# EAGLE design b333 (EAGLE 6.3)

## Sheet 1 of 3
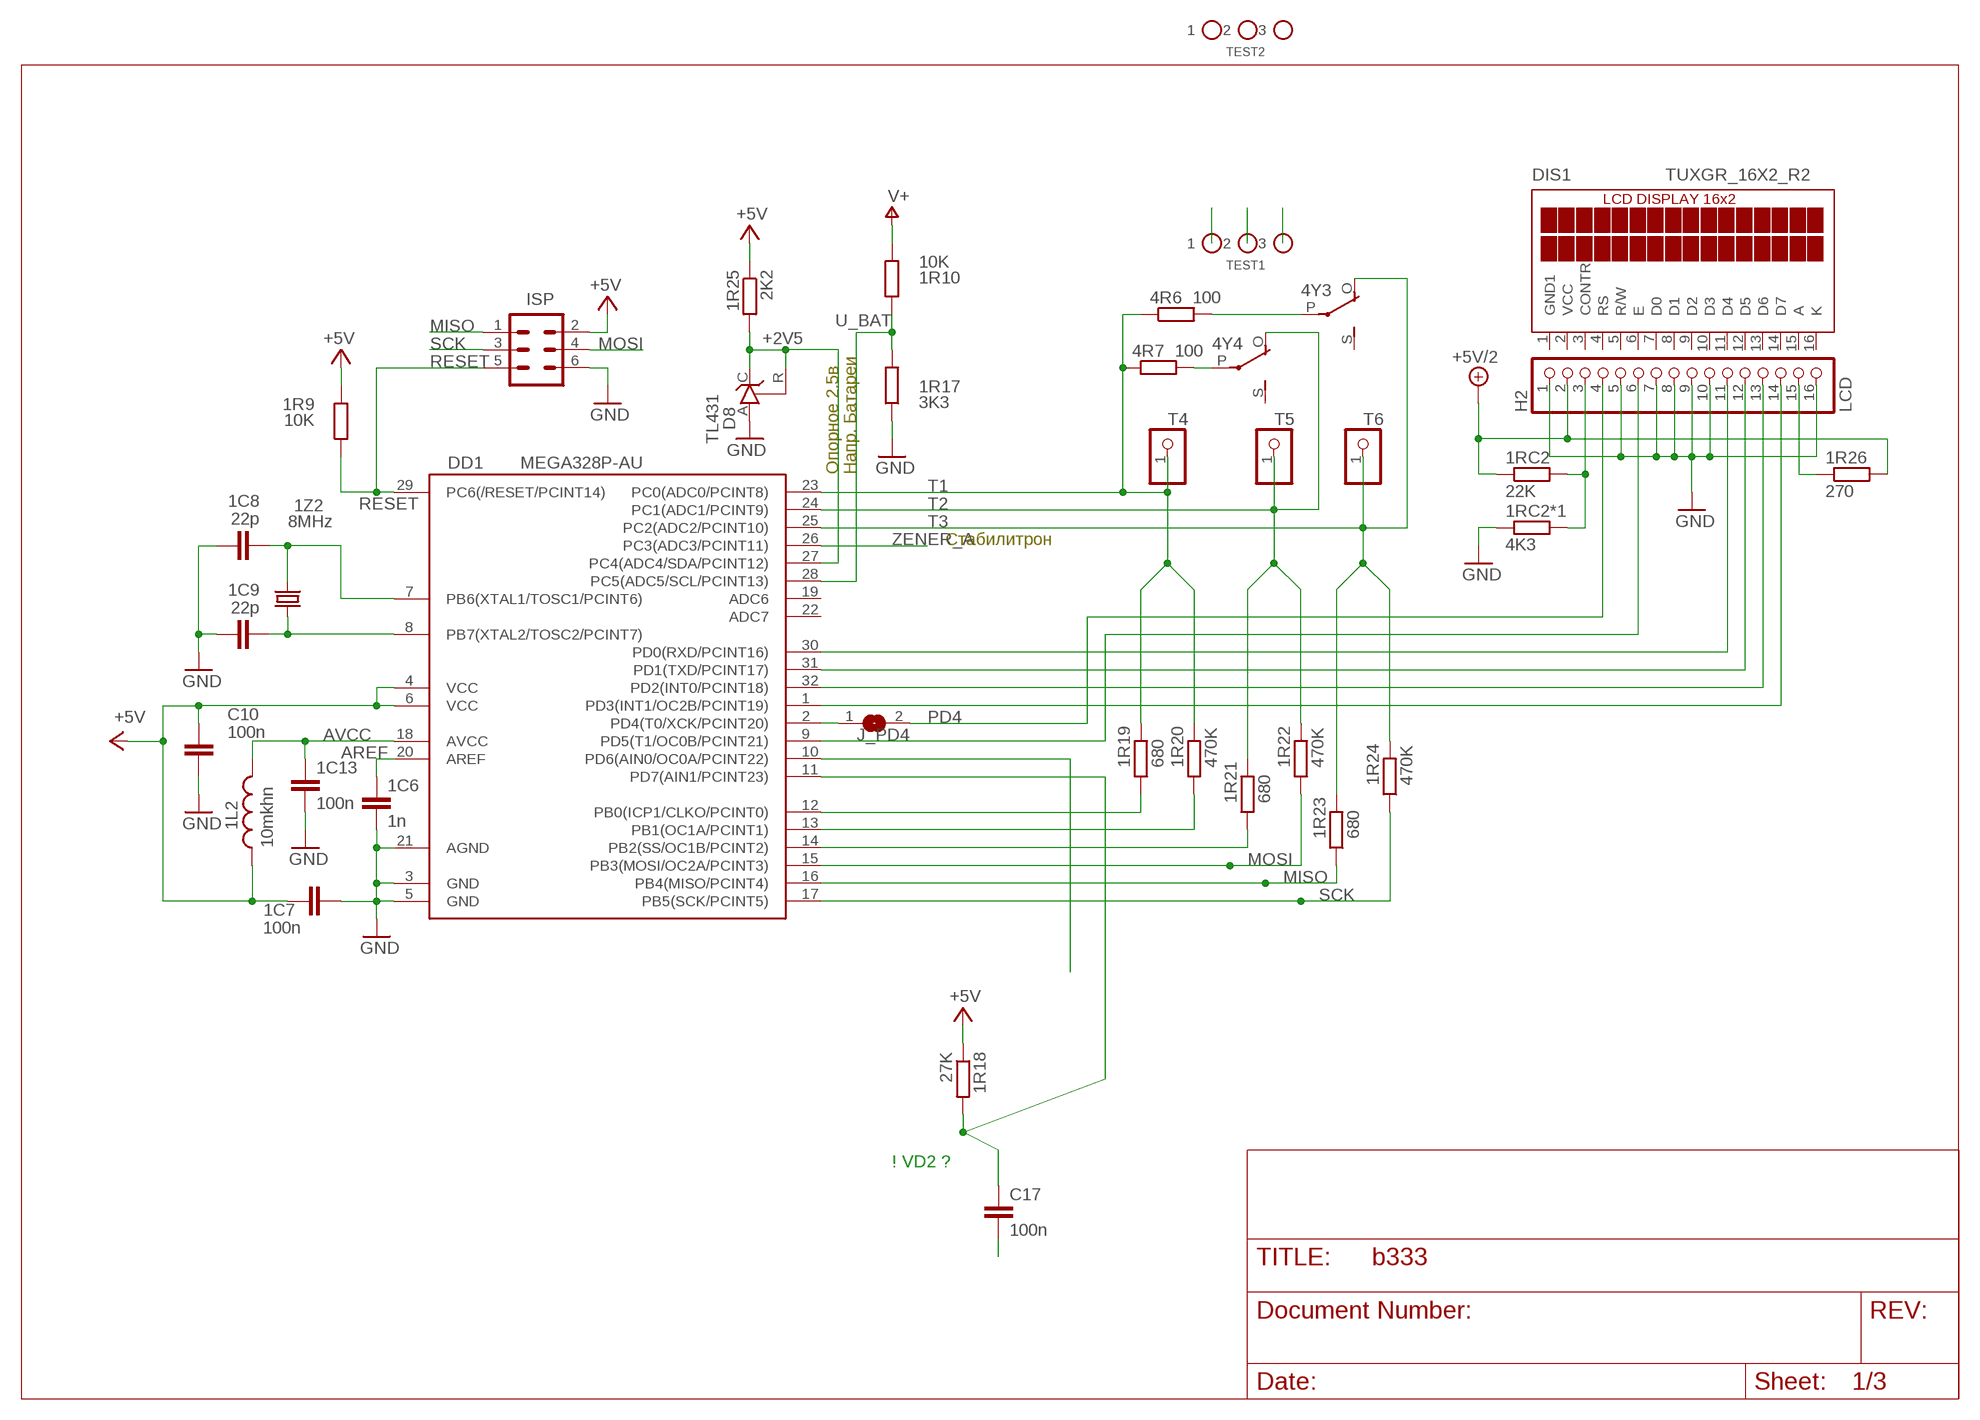
[diagram p0: schematic, sheet 1]

### Parts
1C6  1n  C-EUC0805K  [C0805K]
1C7  100n  C-EUC0805K  [C0805K]
1C8  22p  C-EUC0805K  [C0805K]
1C9  22p  C-EUC0805K  [C0805K]
1C13  100n  C-EUC0805K  [C0805K]
1L2  10mkhn  L-USIRF-24  [IRF24]
1R9  10K  R-EU_R0805  [R0805]
1R10  10K  R-EU_R0805  [R0805]
1R17  3K3  R-EU_R1206W  [R1206W]
1R18  27K  R-EU_R0805  [R0805]
1R19  680  R-EU_M0805  [M0805]
1R20  470K  R-EU_M0805  [M0805]
1R21  680  R-EU_M0805  [M0805]
1R22  470K  R-EU_M0805  [M0805]
1R23  680  R-EU_M0805  [M0805]
1R24  470K  R-EU_M0805  [M0805]
1R25  2K2  R-EU_R0805  [R0805]
1R26  270  R-EU_R1206W  [R1206W]
1RC2  22K  R-EU_R0805  [R0805]
1RC2*1  4K3  R-EU_R1206W  [R1206W]
1Z2  8MHz  CRYSTALHC49U70  [HC49U70]
4R6  100  R-EU_R0805  [R0805]
4R7  100  R-EU_R0805  [R0805]
4Y3  РЭС55А  [РЭС55А]
4Y4  РЭС55А  [РЭС55А]
C10  100n  C-EUC0805  [C0805]
C17  100n  C-EUC0805K  [C0805K]
D8  TL431  TL431CLP  [TO92-CLP]
DD1  MEGA328P-AU  MEGA48/88/168-AU  [TQFP32-08]
DIS1  TUXGR_16X2_R2  [TUXGR_16X2_R2]
H2  LCD  PINHD-1X16  [1X16]
ISP  MA03-2  [MA03-2]
J_PD4  SJ  [SJ]
T4  PINHD-1X1  [1X01]
T5  PINHD-1X1  [1X01]
T6  PINHD-1X1  [1X01]
TEST1  TT-P  [TT-P]
TEST2  TT-P  [TT-P]

### Nets
+2V5: 1R25.2 D8.C D8.R DD1.27(PC4(ADC4/SDA/PCINT12))
+5V: 1C7.1 1L2.2 1R9.2 1R18.1 1R25.1 C10.1 DD1.4(VCC) DD1.6(VCC) ISP.2 ; also sheet 2
+5V/2: 1R26.2 1RC2.1 H2.2 ; also sheet 2
AREF: 1C6.1 DD1.20(AREF)
AVCC: 1C13.1 1L2.1 DD1.18(AVCC)
E1: DD1.9(PD5(T1/OC0B/PCINT21)) H2.6
GND: 1C6.2 1C7.2 1C8.1 1C9.1 1C13.2 1R17.1 1RC2*1.1 C10.2 C17.2 D8.A DD1.3(GND) DD1.5(GND) DD1.21(AGND) H2.1 H2.5 H2.7 H2.8 H2.9 H2.10 H2.16 ISP.6 ; also sheet 2,3
MISO: 1R23.1 DD1.16(PB4(MISO/PCINT4)) ISP.1
MOSI: 1R22.1 DD1.15(PB3(MOSI/OC2A/PCINT3)) ISP.4
N$4: DD1.2(PD4(T0/XCK/PCINT20)) J_PD4.1
N$60: 1RC2*1.2 1RC2.2 H2.3
N$61: 1R26.1 H2.15
N$62: DD1.1(PD3(INT1/OC2B/PCINT19)) H2.14
N$68: 1C8.2 1Z2.2 DD1.7(PB6(XTAL1/TOSC1/PCINT6))
N$69: 1C9.2 1Z2.1 DD1.8(PB7(XTAL2/TOSC2/PCINT7))
N$71: 4R6.2 4Y3.P
N$72: 4R7.2 4Y4.P
N$87: DD1.30(PD0(RXD/PCINT16)) H2.11
N$88: DD1.31(PD1(TXD/PCINT17)) H2.12
N$89: DD1.32(PD2(INT0/PCINT18)) H2.13
PB3: 1R19.1 DD1.12(PB0(ICP1/CLKO/PCINT0))
PB4: 1R20.1 DD1.13(PB1(OC1A/PCINT1))
PB5: 1R21.1 DD1.14(PB2(SS/OC1B/PCINT2))
PD1: 1R18.2 C17.1 DD1.11(PD7(AIN1/PCINT23))
PD2: DD1.10(PD6(AIN0/OC0A/PCINT22))
PD4: H2.4 J_PD4.2 ; also sheet 3
RESET: 1R9.1 DD1.29(PC6(/RESET/PCINT14)) ISP.5
SCK: 1R24.1 DD1.17(PB5(SCK/PCINT5)) ISP.3
T1: 1R19.2 1R20.2 4R6.1 4R7.1 DD1.23(PC0(ADC0/PCINT8)) T4.1 TEST1.P$5
T2: 1R21.2 1R22.2 4Y4.O DD1.24(PC1(ADC1/PCINT9)) T5.1 TEST1.P$2 TEST1.P$3 TEST1.P$4
T3: 1R23.2 1R24.2 4Y3.O DD1.25(PC2(ADC2/PCINT10)) T6.1 TEST1.P$1
U_BAT: 1R10.2 1R17.2 DD1.28(PC5(ADC5/SCL/PCINT13))
V+: 1R10.1 ; also sheet 2
ZENER_A: DD1.26(PC3(ADC3/PCINT11)) ; also sheet 2
Unconnected: 4Y3.1 4Y3.2 4Y3.G 4Y3.S 4Y4.1 4Y4.2 4Y4.G 4Y4.S DD1.19(ADC6) DD1.22(ADC7) DIS1.3(CONTR) DIS1.4(RS) DIS1.5(R/W) DIS1.6(E) DIS1.7(D0) DIS1.8(D1) DIS1.9(D2) DIS1.10(D3) DIS1.11(D4) DIS1.12(D5) DIS1.13(D6) DIS1.14(D7) DIS1.15(A) DIS1.16(K) TEST2.P$1 TEST2.P$2 TEST2.P$3 TEST2.P$4 TEST2.P$5

### Notes on the sheet
- Опорное 2.5в | Напр. Батареи
- Стабилитрон
- ! VD2 ?

## Sheet 2 of 3
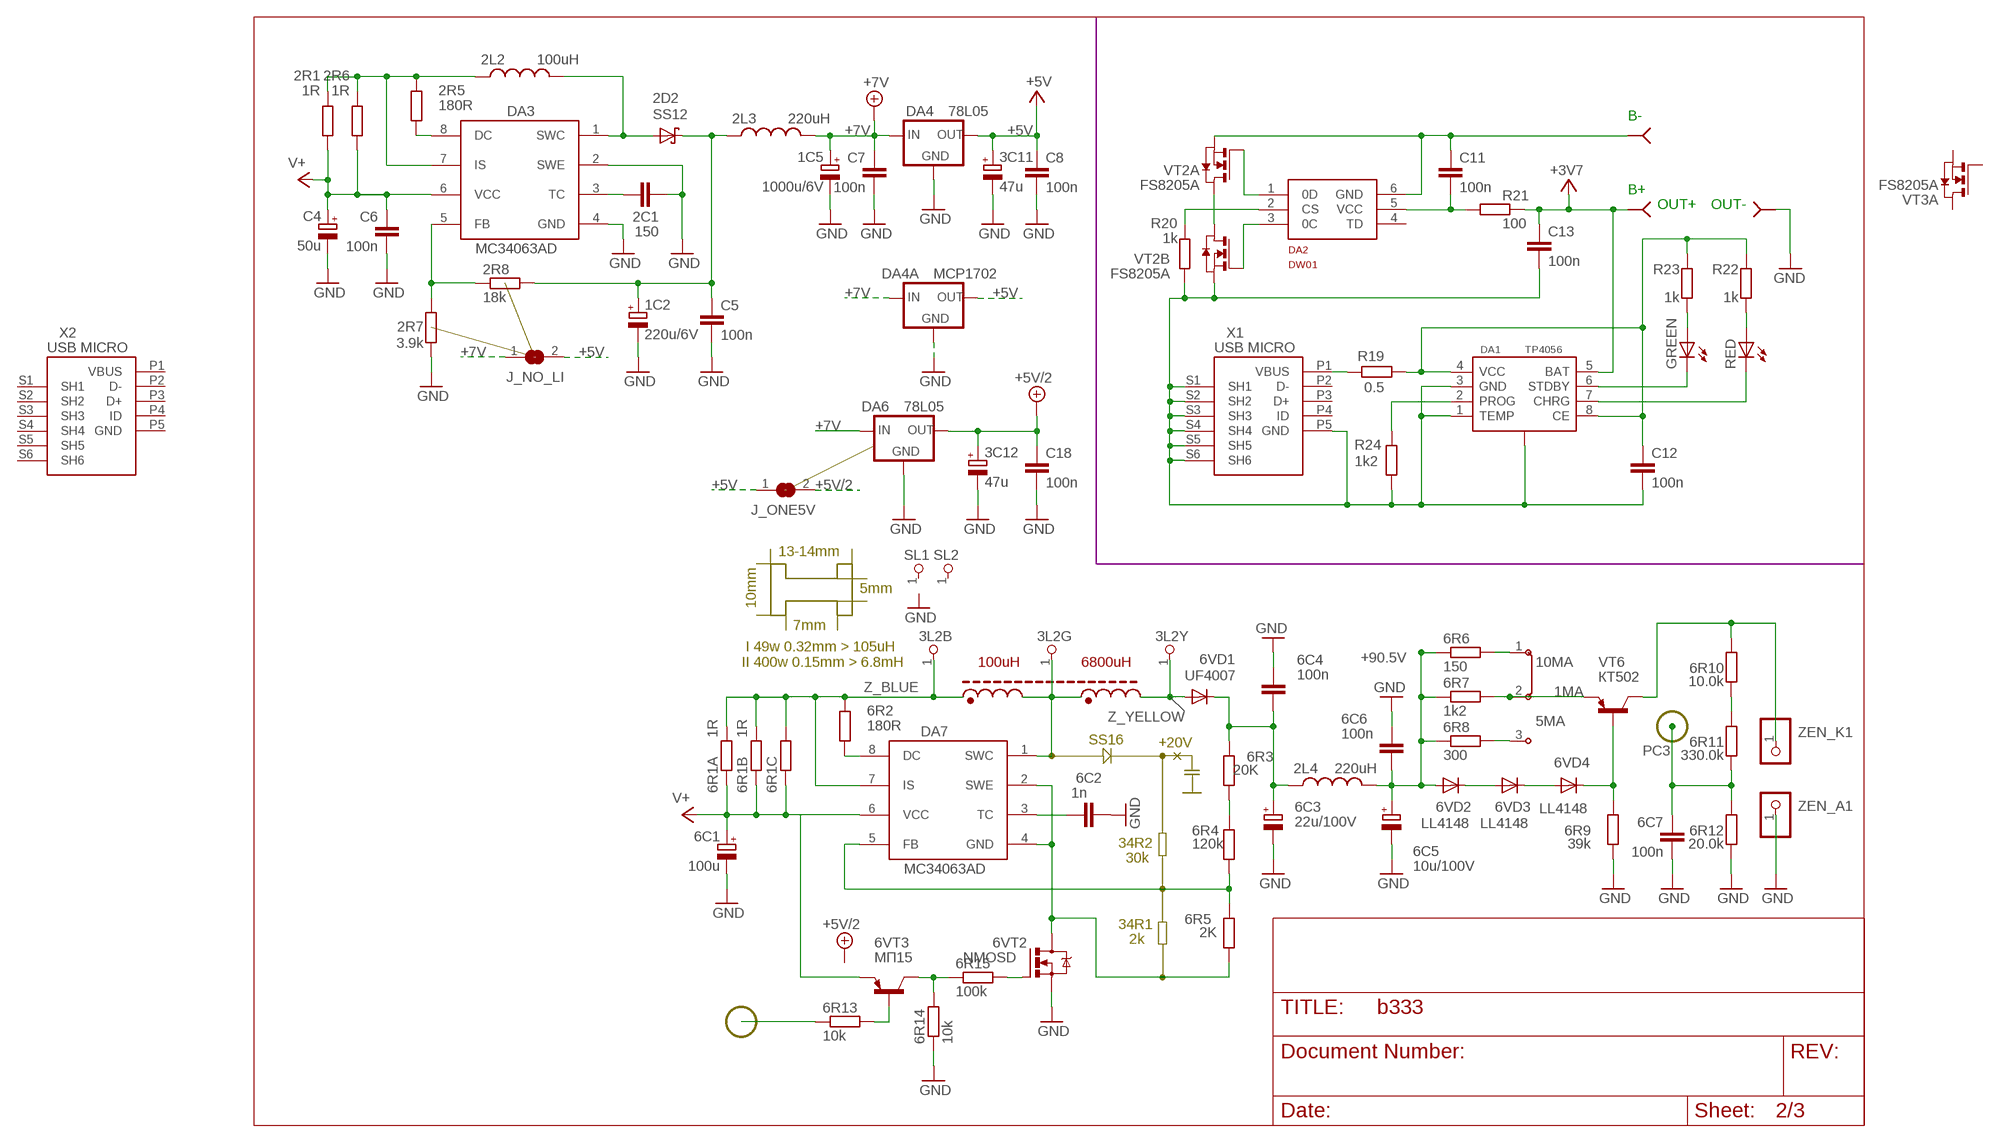
[diagram p1: schematic, sheet 2]

### Parts
1C2  220u/6V  CPOL-EUE2-5  [E2-5]
1C5  1000u/6V  CPOL-EUE2-5  [E2-5]
2C1  150  C-EUC0805K  [C0805K]
2D2  SS12  SCHOTTKY-DIODESMD  [SMB]
2L2  100uH  L_LH7X10MM  [LH7X10MM]
2L3  220uH  L_LV7X10MM  [LV7X10MM]
2L4  220uH  L-US6000-XXX-RC  [6000-XXXX-RC]
2R1  1R  R-EU_R0805  [R0805]
2R5  180R  R-EU_R0805  [R0805]
2R6  1R  R-EU_R0805  [R0805]
2R7  3.9k  R-EU_R0805  [R0805]
2R8  18k  R-EU_R0805  [R0805]
3C11  47u  CPOL-EUE2.5-6  [E2,5-6]
3C12  47u  CPOL-EUE2.5-6  [E2,5-6]
3L2B  PINHD-1X1  [1X01]
3L2G  PINHD-1X1  [1X01]
3L2Y  PINHD-1X1  [1X01]
5MA  10MA  JP2N  [JP2]
6C1  100u  CPOL-EUE2.5-6  [E2,5-6]
6C2  1n  C-EUC0805K  [C0805K]
6C3  22u/100V  CPOL-EUTT5D9L  [TT5D9L]
6C4  100n  C-EU050-025X075  [C050-025X075]
6C5  10u/100V  CPOL-EUE2.5-6  [E2,5-6]
6C6  100n  C-EU025-025X050  [C025-025X050]
6C7  100n  C-EU025-025X050  [C025-025X050]
6R1A  1R  R-EU_R1206  [R1206]
6R1B  1R  R-EU_R1206  [R1206]
6R1C  R-EU_R1206  [R1206]
6R2  180R  R-EU_R0805  [R0805]
6R3  20K  R-EU_R0805  [R0805]
6R4  120k  R-EU_R0805  [R0805]
6R5  2K  R-EU_R0805  [R0805]
6R6  150  R-EU_R0805  [R0805]
6R7  1k2  R-EU_R0805  [R0805]
6R8  300  R-EU_R0805  [R0805]
6R9  39k  R-EU_R0805  [R0805]
6R10  10.0k  R-EU_R0805  [R0805]
6R11  330.0k  R-EU_R0805  [R0805]
6R12  20.0k  R-EU_R0805  [R0805]
6R13  10k  R-EU_R0805  [R0805]
6R14  10k  R-EU_R0805  [R0805]
6R15  100k  R-EU_R0805  [R0805]
6VD1  UF4007  1N4004  [DO41-10]
6VD2  LL4148  DIODE-SOD80C  [SOD80C]
6VD3  LL4148  DIODE-SOD80C  [SOD80C]
6VD4  LL4148  DIODE-SOD80C  [SOD80C]
6VT2  NMOSD  [DPACK_1]
6VT3  МП15  BF423  [TO92-BCE]
B+OUT+  B-  [PAD-]
B-1  B-  [PAD-]
C4  50u  CPOL-EUE2.5-6  [E2,5-6]
C5  100n  C-EUC0805K  [C0805K]
C6  100n  C-EUC0805K  [C0805K]
C7  100n  C-EUC0805K  [C0805K]
C8  100n  C-EUC0805K  [C0805K]
C11  100n  C-EUC0805  [C0805]
C12  100n  C-EUC0805  [C0805]
C13  100n  C-EUC0805  [C0805]
C18  100n  C-EUC0805K  [C0805K]
DA1  TP4056  [SOP-8]
DA2  DW01A  DW01  [SOT23-6]
DA3  MC34063AD  [SOIC8]
DA4  78L05  78LXX_SOT89  [SOT89R]
DA4A  MCP1702  [SOT89R]
DA6  78L05  78LXX_SOT89  [SOT89R]
DA7  MC34063AD  [SOIC8]
GND  B-  [PAD-]
GREEN  LEDCHIP-LED0805  [CHIP-LED0805]
J_NO_LI  SJ  [SJ]
J_ONE5V  SJ  [SJ]
L  L  [L]
R19  0.5  R-EU_R0805  [R0805]
R20  1k  R-EU_R0805  [R0805]
R21  100  R-EU_R0805  [R0805]
R22  1k  R-EU_R0805  [R0805]
R23  1k  R-EU_R0805  [R0805]
R24  1k2  R-EU_0204/7  [0204/7]
RED  LEDCHIP-LED0805  [CHIP-LED0805]
SL1  PINHD-1X1  [1X01]
SL2  PINHD-1X1  [1X01]
VT2  FS8205A  DMN3024LSD  [TSSOP-8]
VT3  FS8205A  DMN3024LSD  [TSSOP-8]
VT6  КТ502  BF423  [TO92-BCE]
X1  USB MICRO  MYCON2_USB-MINI-B  [CON2_USB_MICRO_B_AT]
X2  USB MICRO  MYCON2_USB-MINI-B  [CON2_USB_MICRO_B_AT]
ZEN_A1  PINHD-1X1  [1X01]
ZEN_K1  PINHD-1X1  [1X01]

### Nets
1MA: 5MA.2 6R7.2 VT6.E
5: 6R4.1 6R5.2 DA7.5(FB)
!BUTTON1: 6R13.1
+3V7: B+OUT+.B- C13.1 DA1.5(BAT) R21.2
+5V: 3C11.+ C8.1 DA4.2(OUT) DA4A.1(OUT) J_NO_LI.2 J_ONE5V.1 ; also sheet 1
+5V/2: 3C12.+ C18.1 DA6.2(OUT) J_ONE5V.2 ; also sheet 1
+7V: 1C5.+ 2L3.2 C7.1 DA4.1(IN) DA4A.3(IN) DA4A.4(IN) DA6.1(IN) J_NO_LI.1
+90.5V: 2L4.2 6C5.+ 6C6.2 6R6.1 6R7.1 6R8.1 6VD2.A
B-: B-1.B- C11.1 DA2.6(GND) VT2.2(A:S) VT2.3(A:S)
GND: 1C2.- 1C5.- 2C1.2 2R7.1 3C11.- 3C12.- 6C1.- 6C2.2 6C3.- 6C4.1 6C5.- 6C6.1 6C7.2 6R9.1 6R12.1 6R14.1 6VT2.S C4.- C5.2 C6.2 C7.2 C8.2 C18.2 DA3.2(SWE) DA3.4(GND) DA4.3(GND) DA4.4(GND) DA4A.2(GND) DA6.3(GND) DA6.4(GND) GND.B- ZEN_A1.1 ; also sheet 1,3
N$8: 2C1.1 DA3.3(TC)
N$12: 6R5.1 6VT2.D DA7.2(SWE) DA7.4(GND)
N$13: 2D2.A 2L2.2 DA3.1(SWC)
N$14: 2L2.1 2R1.2 2R5.1 2R6.2 DA3.7(IS)
N$15: 2R5.2 DA3.8(DC)
N$16: 2R7.2 2R8.1 DA3.5(FB)
N$17: 1C2.+ 2D2.C 2L3.1 2R8.2 C5.1
N$19: 2L4.1 6C3.+ 6C4.2 6R3.2 6VD1.C
N$21: 6R14.2 6R15.1 6VT3.C
N$22: 6C2.1 DA7.3(TC)
N$23: 6R3.1 6R4.2
N$24: 6R10.1 6R11.2
N$52: 6R2.2 DA7.8(DC)
N$55: 5MA.3 6R8.2
N$59: 5MA.1 6R6.2
N$65: 6VD2.C 6VD3.A
N$66: 6VD3.C 6VD4.A
N$67: 6R9.2 6VD4.C VT6.B
N$75: VT2.1(A:D) VT2.8(B:D)
N$76: DA2.3(0C) VT2.5(B:G)
N$77: DA2.1(0D) VT2.4(A:G)
N$78: DA2.2(CS) R20.2
N$79: C11.2 DA2.5(VCC) R21.1
N$80: DA1.7(CHRG) RED.C
N$81: DA1.6(STDBY) GREEN.C
N$82: R22.1 RED.A
N$83: GREEN.A R23.1
N$84: C12.1 DA1.4(VCC) DA1.8(CE) R19.2 R22.2 R23.2
N$85: R19.1 X1.P1(VBUS)
N$86: DA1.2(PROG) R24.2
N$95: 6R13.2 6VT3.B
N$96: 6R15.2 6VT2.G
PC3: 6C7.1 6R11.1 6R12.2
UGND: C12.2 C13.2 DA1.1(TEMP) DA1.3(GND) DA1.. R20.1 R24.1 VT2.6(B:S) VT2.7(B:S) X1.P5(GND) X1.S1(SH1) X1.S2(SH2) X1.S3(SH3) X1.S4(SH4) X1.S5(SH5) X1.S6(SH6)
V+: 2R1.1 2R6.1 6C1.+ 6R1A.1 6R1B.1 6R1C.1 6VT3.E C4.+ C6.1 DA3.6(VCC) DA7.6(VCC) ; also sheet 1
Z_BLUE: 3L2B.1 6R1A.2 6R1B.2 6R1C.2 6R2.1 DA7.7(IS)
Z_GREEN: 3L2G.1 DA7.1(SWC)
Z_YELLOW: 3L2Y.1 6VD1.A
ZENER_A: 6R10.2 VT6.C ZEN_K1.1 ; also sheet 1
Unconnected: DA2.4(TD) SL1.1 SL2.1 VT3.1(A:D) VT3.2(A:S) VT3.3(A:S) VT3.4(A:G) VT3.5(B:G) VT3.6(B:S) VT3.7(B:S) VT3.8(B:D) X1.P2(D-) X1.P3(D+) X1.P4(ID) X2.P2(D-) X2.P3(D+) X2.P4(ID) X2.P5(GND) X2.S1(SH1) X2.S2(SH2) X2.S3(SH3) X2.S4(SH4) X2.S5(SH5) X2.S6(SH6)

### Notes on the sheet
- B-
- B+
- OUT+ | OUT-
- I 49w 0.32mm > 105uH
  II 400w 0.15mm > 6.8mH
- 100uH | 6800uH
- +20V
- SS16
- 34R2
- 30k
- 34R1
- 2k

## Sheet 3 of 3
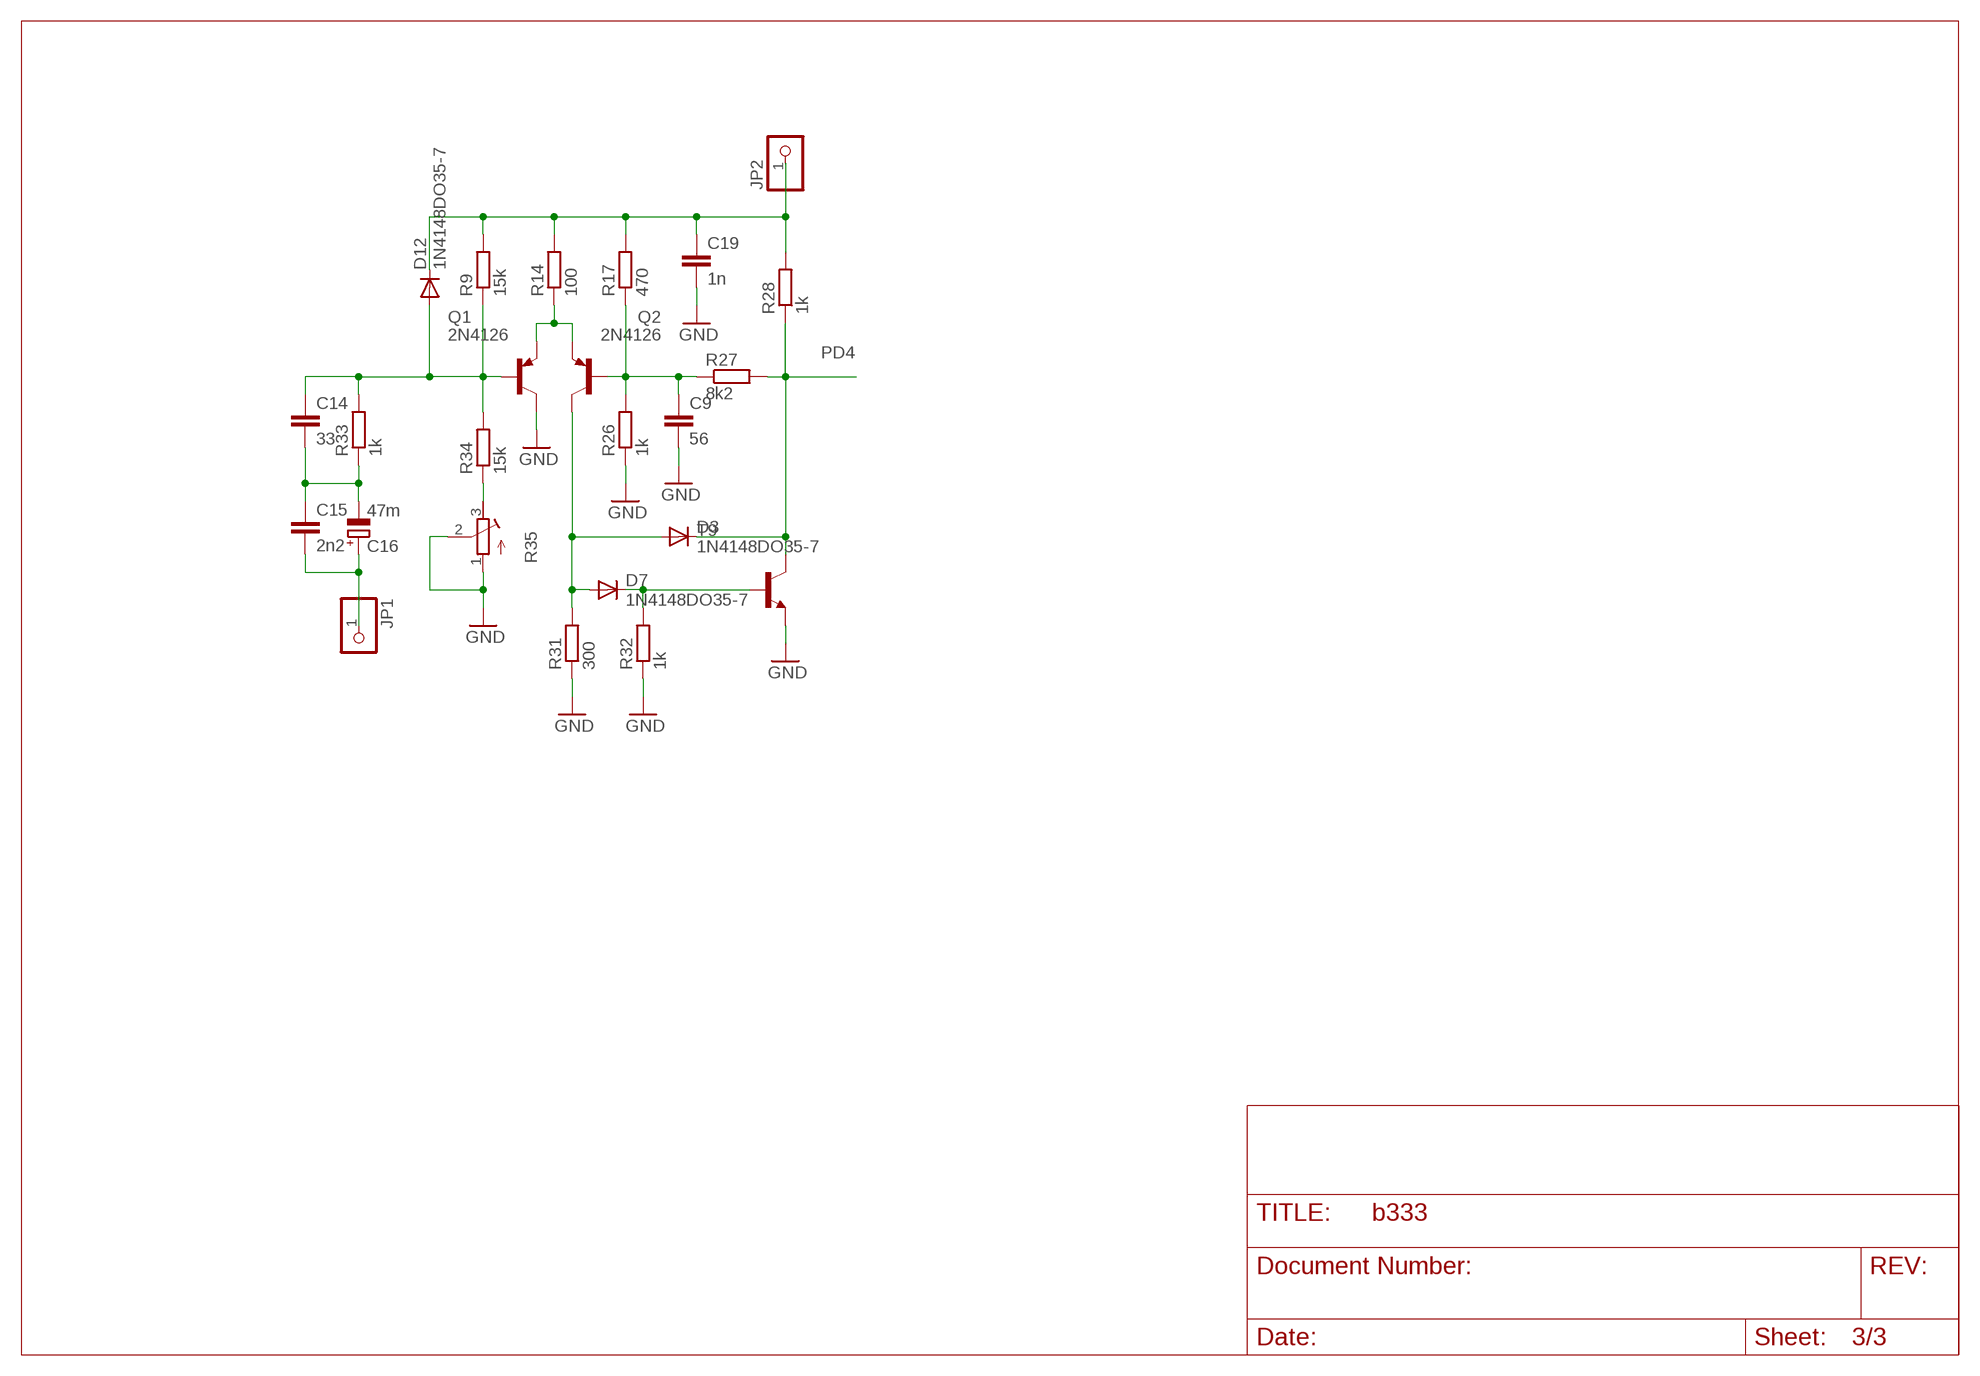
[diagram p2: schematic, sheet 3]

### Parts
C9  56  C-EUC0805K  [C0805K]
C14  33  C-EUC0805K  [C0805K]
C15  2n2  C-EUC0805K  [C0805K]
C16  47m  CPOL-EUE2-4  [E2-4]
C19  1n  C-EUC0805K  [C0805K]
D3  1N4148DO35-7  [DO35-7]
D7  1N4148DO35-7  [DO35-7]
D12  1N4148DO35-7  [DO35-7]
JP1  PINHD-1X1  [1X01]
JP2  PINHD-1X1  [1X01]
Q1  2N4126  [TO92-CBE]
Q2  2N4126  [TO92-CBE]
R9  15k  R-EU_M0805  [M0805]
R14  100  R-EU_M0805  [M0805]
R17  470  R-EU_M0805  [M0805]
R26  1k  R-EU_M0805  [M0805]
R27  8k2  R-EU_M0805  [M0805]
R28  1k  R-EU_M0805  [M0805]
R31  300  R-EU_M0805  [M0805]
R32  1k  R-EU_M0805  [M0805]
R33  1k  R-EU_M0805  [M0805]
R34  15k  R-EU_M0805  [M0805]
R35  R-TRIMM3296W  [RTRIM3296W]
T9  -NPN-TO92-EBC  [TO92-EBC]

### Nets
GND: C9.2 C19.2 Q1.C R26.1 R31.1 R32.1 R35.1(A) R35.2(S) T9.E ; also sheet 1,2
N$3: R34.1 R35.3(E)
N$90: Q1.E Q2.E R14.1
N$91: C14.1 D12.A Q1.B R9.1 R33.2 R34.2
N$93: C9.1 Q2.B R17.1 R26.2 R27.1
N$97: C19.1 D12.C JP2.1 R9.2 R14.2 R17.2 R28.2
N$100: D3.A D7.A Q2.C R31.2
N$101: C14.2 C15.1 C16.- R33.1
N$102: D7.C R32.2 T9.B
N$103: C15.2 C16.+ JP1.1
PD4: D3.C R27.2 R28.1 T9.C ; also sheet 1

## Power pins joined to a net without a drawn wire
GND1: DIS1.1(GND1)
VBUS: X2.P1(VBUS)
VCC: DIS1.2(VCC)

## Library data of the parts
1C2 1C5 3C11 3C12 6C1 6C5 C4 = resistor:CPOL-EU: POLARIZED CAPACITOR, European symbol
1C6-1C9 1C13 2C1 6C2 6C4 6C6 6C7 C5-C8 C10 C17 C18 = resistor:C-EU: CAPACITOR, European symbol
1L2 2L4 = rcl:L-US: INDUCTOR, American symbol
1R9 1R10 1R17-1R26 1RC2 1RC2*1 2R1 2R5-2R8 4R6 4R7 6R1A 6R1B 6R1C 6R2-6R15 R19-R24 = resistor:R-EU_: RESISTOR, European symbol
1Z2 = crystal:CRYSTAL: CRYSTAL; OC_FARNELL: 1666956; OC_NEWARK: unknown
2D2 = diode:SCHOTTKY-DIODE: Schottky Diode
2L2 2L3 = ct-pack:L_: INDUCTOR, American symbol
3L2B 3L2G 3L2Y SL1 SL2 = b333:PINHD-1X1: PIN HEADER
4Y3 4Y4 = relay_ussr:РЭС55
5MA = jumper:JP2N
6C3 = ct-pack:CPOL-EU: POLARIZED CAPACITOR, European symbol
6VD1 = diode:1N4004: DIODE general purpose rectifier, 1 A
6VD2-6VD4 = diode:DIODE-: DIODE
6VT2 = DSS:NMOS
6VT3 VT6 = transistor-pnp:BF423*: PNP Transistror
B+OUT+ B-1 GND = TP4056_18650:B-
C9 C11-C15 C19 = rcl:C-EU: CAPACITOR, European symbol
C16 = rcl:CPOL-EU: POLARIZED CAPACITOR, European symbol
D3 D7 D12 = diode:1N4148: DIODE high speed (Philips)
D8 = v-reg:TL431CLP: VOLTAGE REGULATOR
DA1 = TP4056:TP4056
DA2 = DW01:DW01: The DW01-P battery protection IC is designed to protect lithium-ion/polymer battery from damage or degrading the lifetime due to overcharge, overdischarge, and/or overcurrent for one-cell lithium-ion/polymer battery powered systems, such as cellular phones. Data sheet <http://goo.gl/4y108d> Dave.Calaway Eagle Library <https://goo.gl/Muy1Tr>
DA3 DA7 = mc34063-2:MC34063
DA4 DA6 = ct-pack:78LXX: VOLTAGE REGULATOR
DA4A = ct-pack:MCP1702
DD1 = avr-6:MEGA48/88/168
DIS1 = b333:TUXGR_16X2_R2: Tuxgraphics LCD display 16x2 characters reflective, without background light Source: tuxgr_12x2_r2.pdf; OC_FARNELL: unknown; OC_NEWARK: unknown
GREEN RED = led:LED: LED OSRAM: - CHIPLED LG R971, LG N971, LY N971, LG Q971, LY Q971, LO R971, LY R971 LH N974, LH R974 LS Q976, LO Q976, LY Q976 LO Q996 - Hyper CHIPLED LW Q18S LB Q993, LB Q99A, LB R99A - SideLED LS A670, LO A670, LY A670, LG A670, LP A670 LB A673, LV A673, LT A673, LW A673 LH A674 LY A675 LS A676, LA A676, LO A676, LY A676, LW A676 LS A679, LY A679, LG A679 - Hyper Micro SIDELED® LS Y876, LA Y876, LO Y876, LY Y876 LT Y87S - SmartLED LW L88C, LW L88S LB L89C, LB L89S, LG L890 LS L89K, LO L89K, LY L89K LS L896, LA L896, LO L896, LY L896 - TOPLED LS T670, LO T670, LY T670, LG T670, LP T670 LSG T670, LSP T670, LSY T670, LOP T670, LYG T670 LG T671, LOG T671, LSG T671 LB T673, LV T673, LT T673, LW T673 LH T674 LS T676, LA T676, LO T676, LY T676, LB T676, LH T676, LSB T676, LW T676 LB T67C, LV T67C, LT T67C, LS T67K, LO T67K, LY T67K, LW E67C LS E67B, LA E67B, LO E67B, LY E67B, LB E67C, LV E67C, LT E67C LW T67C LS T679, LY T679, LG T679 LS T770, LO T770, LY T770, LG T770, LP T770 LB T773, LV T773, LT T773, LW T773 LH T774 LS E675, LA E675, LY E675, LS T675 LS T776, LA T776, LO T776, LY T776, LB T776 LHGB T686 LT T68C, LB T68C - Hyper Mini TOPLED® LB M676 - Mini TOPLED Santana® LG M470 LS M47K, LO M47K, LY M47K Source: http://www.osram.convergy.de LUXEON: - LUMILED® LXK2-PW12-R00, LXK2-PW12-S00, LXK2-PW14-U00, LXK2-PW14-V00 LXK2-PM12-R00, LXK2-PM12-S00, LXK2-PM14-U00 LXK2-PE12-Q00, LXK2-PE12-R00, LXK2-PE12-S00, LXK2-PE14-T00, LXK2-PE14-U00 LXK2-PB12-K00, LXK2-PB12-L00, LXK2-PB12-M00, LXK2-PB14-N00, LXK2-PB14-P00, LXK2-PB14-Q00 LXK2-PR12-L00, LXK2-PR12-M00, LXK2-PR14-Q00, LXK2-PR14-R00 LXK2-PD12-Q00, LXK2-PD12-R00, LXK2-PD12-S00 LXK2-PH12-R00, LXK2-PH12-S00 LXK2-PL12-P00, LXK2-PL12-Q00, LXK2-PL12-R00 Source: www.luxeon.com KINGBRIGHT: KA-3528ASYC Source: www.kingbright.com
H2 = pinhead:PINHD-1X16: PIN HEADER
ISP = con-lstb:MA03-2: PIN HEADER
J_NO_LI J_ONE5V J_PD4 = jumper:SJ: SMD solder JUMPER
JP1 JP2 T4-T6 ZEN_A1 ZEN_K1 = pinhead:PINHD-1X1: PIN HEADER
L = b333:L
Q1 Q2 = transistor-pnp:2N4126*: PNP Transistror
R9 R14 R17 R26-R28 R31-R34 = rcl:R-EU_: RESISTOR, European symbol
R35 = rcl:R-TRIMM: Trimm resistor
T9 = transistor:*-NPN-: NPN Transistror BF959 corrected 2008.03.06
TEST1 TEST2 = transistor_tester:TT-P
VT2 VT3 = FS8205A:DMN3024LSD: DUAL N-CHANNEL ENHANCEMENT MODE MOSFET data sheet <http://goo.gl/dRgboR> Dave.Calaway Eagle Library <https://goo.gl/Muy1Tr>
X1 X2 = SmartPrj:MYCON2_USB-MINI-B

## Board
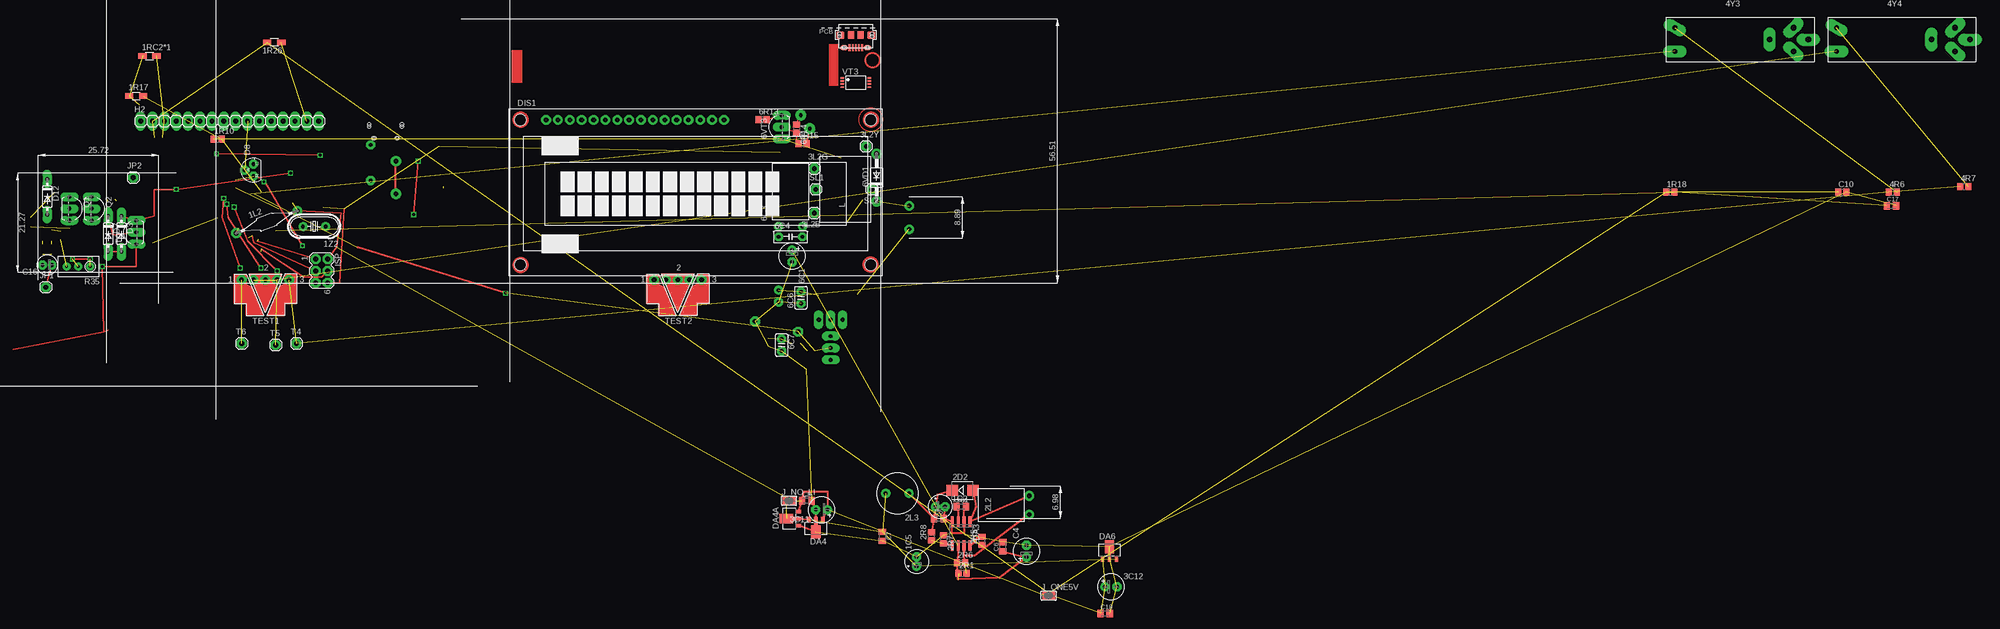
[diagram p3: board, top side]
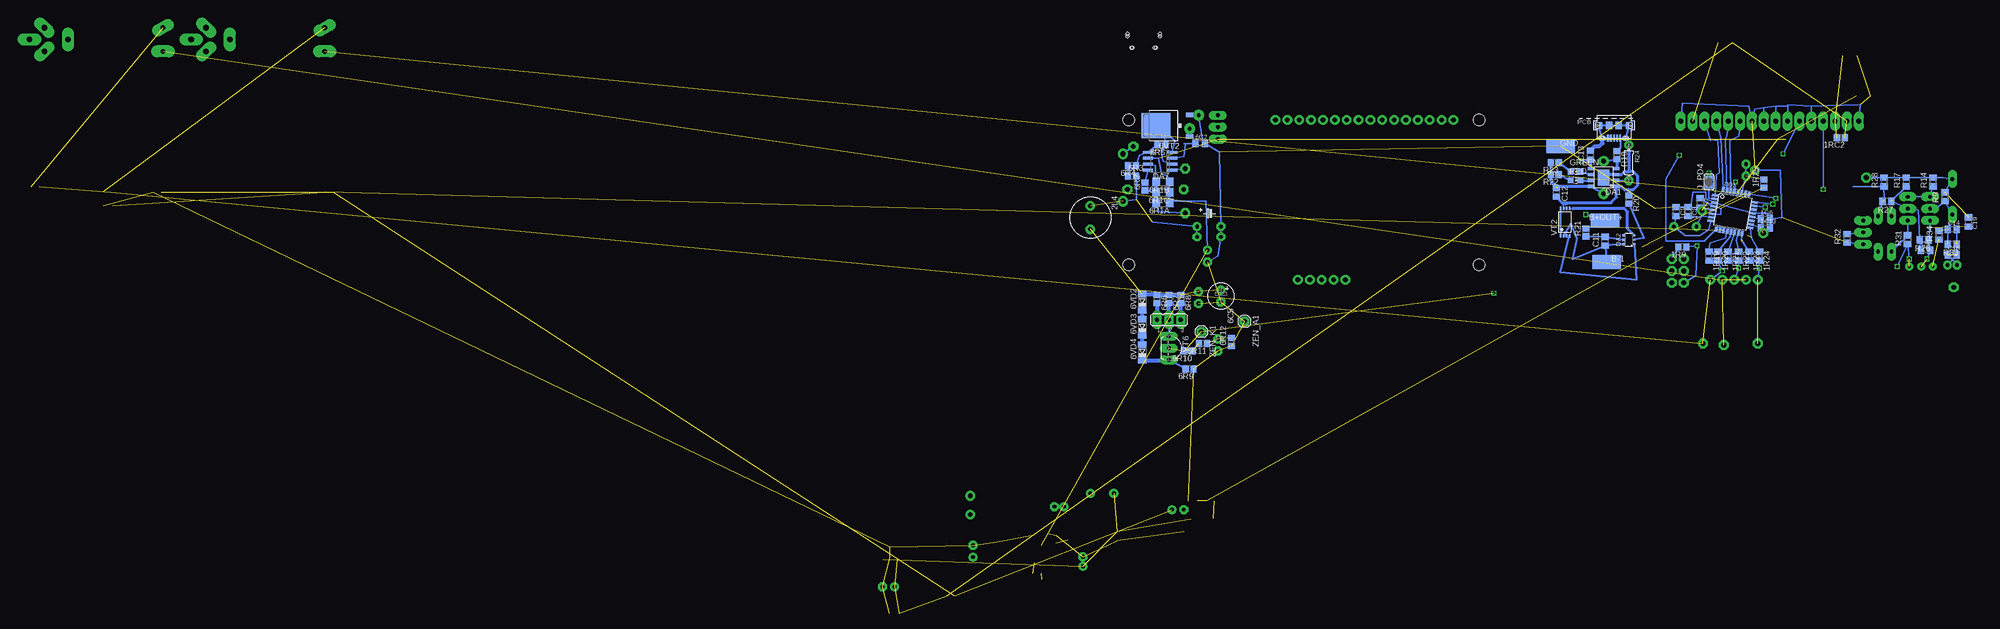
[diagram p4: board, bottom side, seen from below]

No outline drawn. Coordinates in mm, seen from the top.
Copper layers (1*16): Top 0.035mm / dielectric 1.5mm / Bottom 0.035mm
Design rules "DesignRules": minimum track width 8mil, minimum drill 24mil, track to track 0.2mm, track to pad 0.2mm, pad to pad 8mil, via to via 8mil, smd to smd 8mil, copper to edge 10mil, drill to drill 8mil, minimum pad ring 0.55mm, minimum via ring 8mil, stop-mask expansion 4mil, vias tented up to drill 0mil, thermal gap 10mil

### Footprints (pad centres in the part's own frame; a part is rotated, then mirrored left to right if it is on the bottom)
E2-5 = drill 0.813 pad 1.27: + -1.016,0 | drill 0.813 pad 1.27 octagon: - 1.016,0
C0805K = smd 1.3 x 1.6: 1 -1,0; 2 1,0
IRF24 = drill 1 pad 1.676: 1 -6.985,0; 2 6.985,0
R0805 = smd 1.3 x 1.5: 1 -0.85,0; 2 0.85,0
R1206W = smd 1.8 x 1.2: 1 -1.499,0; 2 1.499,0
M0805 = smd 1.3 x 1.6: 1 -0.95,0; 2 0.95,0
HC49U70 = drill 0.813: 1 -2.413,0; 2 2.413,0
SMB = smd 2.4 x 2.4: A 2.2,0; C -2.2,0
LH7X10MM = drill 1: 1 -2,-6; 2 2,-6
6000-XXXX-RC = drill 0.9 pad 1.422: 1 -2.5,0; 2 2.5,0
E2,5-6 = drill 0.813 pad 1.6: + -1.27,0 | drill 0.813 pad 1.6 octagon: - 1.27,0
1X01 = drill 1.016 octagon: 1 0,0
РЭС55А = drill 1.2 pad 2.54 long: 1 13.335,3.175; 2 13.335,-1.905; G 8.255,0.635; S 16.51,0.635 | drill 1 pad 2.54 long: O -12.065,-1.905; P -12.065,3.175
JP2 = drill 0.914 long: 1 -2.54,0; 2 0,0; 3 2.54,0
TT5D9L = drill 0.813 pad 1.6: + 2.54,0 | drill 0.813 pad 1.6 octagon: - -2.54,0
C050-025X075 = drill 0.813 octagon: 1 -2.54,0; 2 2.54,0
C025-025X050 = drill 0.813 octagon: 1 -1.27,0; 2 1.27,0
R1206 = smd 1.6 x 1.803: 1 -1.422,0; 2 1.422,0
DO41-10 = drill 1.118: A 5.08,0; C -5.08,0
SOD80C = smd 1.4 x 1.8: A 1.7,0; C -1.7,0
DPACK_1 = smd 5.4 x 6.2: D 0,2.5 | smd 1 x 1.6: G -2.28,-4.8; S 2.28,-4.8
TO92-BCE = drill 0.813 long: B 2.54,0; C 0,0; E -2.54,0
PAD- = smd 3 x 6: B- 0,0
C0805 = smd 1.3 x 1.5: 1 -0.85,0; 2 0.85,0
C0805' = smd 1.3 x 1.5: 1 -0.95,0; 2 0.95,0
E2-4 = drill 0.813 pad 1.27: + -1.016,0 | drill 0.813 pad 1.27 octagon: - 1.016,0
DO35-7 = drill 0.813 long: A 3.81,0; C -3.81,0
TO92-CLP = drill 0.813 octagon: A 0,1.905; C 1.27,0; R -1.27,0
SOP-8 = smd 1.3 x 0.7: 1 -2.75,1.905; 2 -2.75,0.635; 3 -2.75,-0.635; 4 -2.75,-1.905; 5 2.75,-1.905; 6 2.75,-0.635; 7 2.75,0.635; 8 2.75,1.905 | smd 2.413 x 3.429: . 0,0
SOT23-6 = smd 0.4 x 0.55: 1 -0.95,-1.15; 2 0,-1.15; 3 0.95,-1.15 | smd 0.55 x 0.55: 4 0.95,1.15; 5 0,1.15; 6 -0.95,1.15
SOIC8 = smd 0.6 x 2.2: 1 -1.905,-2.6; 2 -0.635,-2.6; 3 0.635,-2.6; 4 1.905,-2.6; 5 1.905,2.6; 6 0.635,2.6; 7 -0.635,2.6; 8 -1.905,2.6
SOT89R = smd 0.7 x 1.1: 1 1.5,-1.75; 2 -1.5,-1.75 | smd 0.7 x 1.8: 3 0,-1.4 | smd 2 x 2.8: 4 0,0.9
TQFP32-08 = smd 1.27 x 0.559: 1 -4.293,2.8; 2 -4.293,2; 3 -4.293,1.2; 4 -4.293,0.4; 5 -4.293,-0.4; 6 -4.293,-1.2; 7 -4.293,-2; 8 -4.293,-2.8; 17 4.293,-2.8; 18 4.293,-2; 19 4.293,-1.2; 20 4.293,-0.4; 21 4.293,0.4; 22 4.293,1.2; 23 4.293,2; 24 4.293,2.8 | smd 0.559 x 1.27: 9 -2.8,-4.293; 10 -2,-4.293; 11 -1.2,-4.293; 12 -0.4,-4.293; 13 0.4,-4.293; 14 1.2,-4.293; 15 2,-4.293; 16 2.8,-4.293; 25 2.8,4.293; 26 2,4.293; 27 1.2,4.293; 28 0.4,4.293; 29 -0.4,4.293; 30 -1.2,4.293; 31 -2,4.293; 32 -2.8,4.293
TUXGR_16X2_R2 = drill 1 pad 1.676: 1 -32,15.5; 2 -29.46,15.5; 3 -26.92,15.5; 4 -24.38,15.5; 5 -21.84,15.5; 6 -19.3,15.5; 7 -16.76,15.5; 8 -14.22,15.5; 9 -11.68,15.5; 10 -9.14,15.5; 11 -6.6,15.5; 12 -4.06,15.5; 13 -1.52,15.5; 14 1.02,15.5; 15 3.56,15.5; 16 6.1,15.5 | hole 2.5: -37.5,-15.5; 37.5,-15.5; -37.5,15.5; 37.5,15.5
CHIP-LED0805 = smd 1.2 x 1.2: A 0,-1.05; C 0,1.05
1X16 = drill 1.016 long: 1 -19.05,0; 2 -16.51,0; 3 -13.97,0; 4 -11.43,0; 5 -8.89,0; 6 -6.35,0; 7 -3.81,0; 8 -1.27,0; 9 1.27,0; 10 3.81,0; 11 6.35,0; 12 8.89,0; 13 11.43,0; 14 13.97,0; 15 16.51,0; 16 19.05,0
MA03-2 = drill 1.016: 1 -2.54,-1.27 | drill 1.016 octagon: 2 -2.54,1.27; 3 0,-1.27; 4 0,1.27; 5 2.54,-1.27; 6 2.54,1.27
SJ = smd 1.168 x 1.6: 1 -0.762,0; 2 0.762,0
TO92-CBE = drill 0.813 long: B 0,0; C 2.54,0; E -2.54,0
0204/7 = drill 0.813 octagon: 1 -3.81,0; 2 3.81,0
RTRIM3296W = drill 0.61: 1 0,-2.54; 2 0,0; 3 0,2.54
TO92-EBC = drill 0.813 long: B 0,-1.27; C 2.54,-1.27; E -2.54,-1.27
TT-P = drill 1 pad 2: P$1 -5.08,5.08; P$2 -2.54,5.08; P$3 0,5.08; P$4 2.54,5.08; P$5 5.08,5.08
TSSOP-8 = smd 0.3 x 0.75: 1 -0.975,-2.925; 2 -0.325,-2.925; 3 0.325,-2.925; 4 0.975,-2.925; 5 0.975,2.925; 6 0.325,2.925; 7 -0.325,2.925; 8 -0.975,2.925
CON2_USB_MICRO_B_AT = smd 0.406 x 1.346: P1 -1.321,2.692; P2 -0.66,2.692; P3 0,2.692; P4 0.66,2.692; P5 1.321,2.692 | smd 1.651 x 1.549: S1 -3.302,0; S2 3.302,0 | smd 1.524 x 1.016: S3 -2.489,2.692; S4 2.489,2.692 | smd 1.524 x 1.524: S5 -1.016,0; S6 1.016,0 | hole 0.7: -3.505,0.254; -3.505,-0.254; 3.505,0.254; 3.505,-0.254; -2.616,2.692; -2.362,2.692; 2.362,2.692; 2.616,2.692

### Placement (x,y rotation side)
1C2  244.16,27.3 0 top
1C5  239.08,15.56 90 top
1C6  93.03,88.9 0 bottom
1C7  107,92.39 270 bottom
1C8  109.54,90.49 270 bottom
1C9  112.08,90.49 270 bottom
1C13  93.03,87 0 bottom
1L2  100.01,88.27 20 top
1R9  110.81,82.87 180 bottom
1R10  89.53,106.05 0 top
1R17  72.07,115.25 0 top
1R18  400.37,94.61 0 top
1R19  105.09,80.96 270 bottom
1R20  103.19,80.96 270 bottom
1R21  100.97,80.96 270 bottom
1R22  98.74,80.96 270 bottom
1R23  96.52,80.96 270 bottom
1R24  94.3,80.96 270 bottom
1R25  93.34,96.52 90 bottom
1R26  101.6,126.68 180 top
1RC2  76.83,106.36 180 bottom
1RC2*1  74.93,123.83 0 top
1Z2  110.17,87.31 180 top
2C1  248.6,27.3 0 top
2D2  248.92,30.8 0 top
2L2  257.18,27.62 90 top
2L3  220uH  [6000-XXXX-RC]  234.95,30.16 180 top
2L4  237.49,89.22 270 bottom
2R1  248.92,13.02 0 top
2R5  253.05,20 90 top
2R6  248.6,15.24 0 top
2R7  244.79,20.32 270 top
2R8  242.25,20.95 90 top
3C11  218.76,26.67 180 top
3C12  280.67,10.16 0 top
3L2B  217.17,90.17 180 top
3L2G  217.17,99.69 0 top
3L2Y  228.28,104.46 0 top
4R6  447.99,94.61 0 top
4R7  463.23,95.89 0 top
4Y3  413.38,126.68 0 top
4Y4  447.99,126.68 0 top
5MA  220.66,67.31 0 bottom
6C1  212.41,80.96 270 top
6C2  214,105.09 0 bottom
6C3  212.09,87.31 0 top
6C4  212.09,85.09 0 top
6C5  209.55,72.39 270 bottom
6C6  214.31,72.07 90 top
6C7  210.19,61.91 270 top
6R1A  221.93,92.39 180 bottom
6R1B  221.93,96.84 180 bottom
6R1C  221.93,94.61 180 bottom
6R2  225.74,95.89 90 bottom
6R3  228.6,98.11 0 bottom
6R4  228.6,100.33 180 bottom
6R5  222.25,104.78 180 bottom
6R6  223.2,71.75 270 bottom
6R7  220.66,71.75 270 bottom
6R8  218.12,71.75 270 bottom
6R9  216.22,56.83 180 bottom
6R10  216.53,60.64 180 bottom
6R11  213.36,62.23 180 bottom
6R12  207.33,62.55 90 bottom
6R13  206.06,110.17 0 top
6R14  213.36,108.27 270 top
6R15  214.63,105.09 0 top
6VD1  230.5,97.79 90 top
6VD2  226.38,71.12 90 bottom
6VD3  226.38,65.72 90 bottom
6VD4  226.38,60.33 90 bottom
6VT2  220.98,108.9 90 bottom
6VT3  210.19,108.58 90 top
B+OUT+  127.32,88.58 90 bottom
B-1  127,79.69 90 bottom
C4  262.57,17.78 90 top
C5  243.84,24.77 0 top
C6  257.49,18.73 90 top
C7  231.78,20.95 270 top
C8  215.58,28.57 0 top
C9  58.74,82.23 0 bottom
C10  437.2,94.61 0 top
C11  100n  [C0805']  127.32,84.14 90 bottom
C12  100n  [C0805']  137.79,94.61 270 bottom
C13  100n  [C0805']  130.49,102.55 90 bottom
C14  53.02,86.68 0 bottom
C15  53.02,81.28 0 bottom
C16  53.02,79.06 180 top
C17  447.68,91.76 0 top
C18  279.4,4.45 0 top
C19  49.53,88.27 270 bottom
D3  68.9,85.72 270 top
D7  66.04,85.72 270 top
D8  97.16,99.38 90 top
D12  53.02,93.66 270 top
DA1  127.64,97.79 180 bottom
DA2  122.24,84.45 90 bottom
DA3  248.6,21.59 180 top
DA4  217.49,22.86 180 top
DA4A  212.09,24.77 90 top
DA6  280.35,17.78 0 top
DA7  222.57,101.28 90 bottom
DD1  100.01,90.49 350 bottom
DIS1  191.77,94.61 0 top
GND  136.84,104.46 90 bottom
GREEN  133.67,99.06 270 bottom
H2  92.08,109.86 0 top
ISP  111.76,77.79 270 top
J_NO_LI  211.77,28.57 0 top
J_ONE5V  267.33,8.26 0 top
J_PD4  105.09,96.84 90 bottom
JP1  52.7,74.3 0 top
JP2  71.44,97.79 0 top
L  223.84,95.25 90 top
Q1  57.78,91.12 270 top
Q2  62.55,91.12 270 top
R9  54.61,93.66 90 bottom
R14  57.15,96.84 90 bottom
R17  62.87,96.84 90 bottom
R19  124.78,102.55 270 bottom
R20  122.24,93.03 270 bottom
R21  131.44,86.04 90 bottom
R22  138.11,98.42 180 bottom
R23  138.11,100.97 180 bottom
R24  122.24,100.97 270 bottom
R26  59.05,84.45 180 bottom
R27  66.99,92.71 180 bottom
R28  67.63,96.84 90 bottom
R31  62.55,84.45 90 bottom
R32  75.56,84.77 90 bottom
R33  53.02,83.5 180 bottom
R34  55.88,85.41 90 bottom
R35  59.69,78.74 90 top
RED  133.67,97.16 270 bottom
SL1  217.49,95.25 0 top
SL2  229.55,95.25 180 top
T4  106.36,62.23 0 top
T5  101.92,61.91 0 top
T6  94.61,62.23 0 top
T9  70.8,86.04 90 top
TEST1  99.69,70.8 0 top
TEST2  187.96,70.8 0 top
U$8  [F18650]  185.74,122.56 0 top
VT2  135.89,88.27 0 bottom
VT3  226.06,118.11 270 top
VT6  220.66,61.28 270 bottom
X1  125.41,108.9 180 bottom
X2  226.06,128.27 180 top
ZEN_A1  204.47,66.99 270 bottom
ZEN_K1  213.68,64.77 270 bottom

### Tracks (layer width: path | path; a pad name or v marks a point on that pad's centre or on a via)
1MA
  Bottom 0.406: 5MA.2 VT6.E
  Bottom 0.813: 5MA.2 6R7.2
5
  Bottom 0.305: 6R5.2 DA7.5 227.01,102.55 6R4.1
+2V5  (1 unrouted)
  Bottom 0.305: D8.C D8.R DD1.27
+3V7  (via drill 0.6)
  Top 0.305: v131.44,89.85 v132.4,101.28
  Bottom 0.305: B+OUT+.B- v131.44,89.85 | v132.4,101.28 C13.1
  Bottom 0.406: R21.2 B+OUT+.B-
  Bottom 0.61: C13.1 130.49,99.8 DA1.5
+5V  (7 unrouted)
  Top 0.305: 1L2.2 115.89,90.17 114.94,82.87 ISP.2
  Top 0.406: DA4.2 3C11.+ 220.03,30.48 214.95,30.48 C8.1 DA4A.1
  Bottom 0.305: 1C7.1 105.41,92.39 DD1.4 102.55,91.12 102.55,89.85 DD1.6 | 1R9.2 ISP.2
+5V/2  (6 unrouted)
+7V  (5 unrouted)
  Top 0.406: DA4.1 DA4A.3 DA4A.4
+90.5V  (3 unrouted)
  Bottom 0.813: 6R8.1 6R7.1 6R6.1 223.74,72.82 6VD2.A
AREF
  Bottom 0.305: 1C6.1 DD1.20
AVCC  (1 unrouted)
  Bottom 0.305: DD1.18 1C13.1
B-
  Bottom 0.406: DA2.6 C11.1 | VT2.3 VT2.2 134.62,87.95 133.35,84.77 134.3,80.33 C11.1 | C11.1 B-1.B-
E1  (via drill 0.6)
  Top 0.305: v89.22,102.87 v111.44,102.55
  Bottom 0.305: H2.6 v89.22,102.87 | DD1.9 106.05,84.14 114.3,84.14 114.3,97.47 v111.44,102.55
GND  (via drill 0.6, 0.8 pad 2.3)  (29 unrouted)
  Top 0.305: T9.E 72.07,78.74 v64.77,78.74 65.16,64.72 | 66.04,65.09 65.16,64.72 | 65.16,64.72 45.72,60.96 | v62.23,80.33 v58.42,80.33 | ISP.6 115.57,75.25 116.52,91.12 | v214.31,111.12 213.68,110.17 6R14.1
  Top 0.406: 249.24,21.59 DA3.2 249.24,26.94 2C1.2 | 249.24,21.59 246.7,21.59 DA3.4 C5.2 1C2.- | 249.24,21.59 249.51,21.32 | DA4A.2 DA4.4 DA4.3 3C11.- C8.2
  Bottom 0.305: 1C6.2 92.39,90.17 DD1.21 101.82,91.81 DD1.3 105.73,93.34 105.73,94.61 108.58,94.61 108.92,91.47 | 1C13.2 1C6.2 | DD1.5 1C7.2 108.92,91.47 | 1C9.1 1C8.1 108.92,91.47 | Q1.C 57.78,86.98 R26.1 C9.2 v58.42,80.33 | v64.77,78.74 R31.1 v62.23,80.33 | R32.1 T9.E | D8.A 89.85,99.38 89.53,89.22 1C6.2 | 6VT2.S v214.31,111.12 213.36,105.41 | 213.36,105.41 209.87,103.19 6C3.- 6C4.1 210.19,80.96 6C1.- | H2.1 72.71,113.35 83.19,113.03 | 83.19,113.03 H2.5 | H2.7 88.27,113.03 | 88.27,113.03 88.27,113.35 83.19,113.03 | H2.8 90.81,113.03 | 90.81,113.03 88.27,113.03 | H2.9 93.34,112.71 | 93.34,112.71 90.81,113.03 | 93.34,112.71 95.25,112.39 H2.10 96.52,113.03 110.81,113.67 H2.16 | 213.36,105.41 6C2.2
MISO  (1 unrouted)
  Top 0.305: ISP.1 97.98,84.22
  Bottom 0.305: 1R23.1 98.17,84.51 DD1.16
MOSI  (1 unrouted)
  Top 0.305: ISP.4 111.76,76.52 107.95,76.52 98.86,82.45
  Bottom 0.305: 1R22.1 99.28,84.36 DD1.15
N$3  (1 unrouted)
N$4
  Bottom 0.305: DD1.2 105.09,93.34 J_PD4.1
N$8
  Top 0.406: 2C1.1 247.97,26.94 DA3.3
N$12
  Bottom 0.305: 221.75,107.56 219.39,105.73 219.62,104.71 DA7.4 | 221.75,107.56 6VT2.D | DA7.2 221.93,101.28 222.25,103.19 6R5.1 221.75,107.56
N$13
  Top 0.406: 2D2.A 251.78,27.3 DA3.1 2L2.2
N$14  (1 unrouted)
  Top 0.305: 2R5.1 253.4,18.26
  Top 0.406: 2L2.1 253.4,18.26 251.46,16.83 249.24,16.83 | 249.24,16.83 DA3.7 | 2R6.2 249.24,16.83
N$15
  Top 0.406: DA3.8 251.46,19.68 252.09,20.64 2R5.2
N$16  (1 unrouted)
  Top 0.406: DA3.5 2R7.2
N$17
  Top 0.406: 2D2.C 243.52,29.84 1C2.+ C5.1 | C5.1 2R8.2 | C5.1 2L3.1
N$19  (2 unrouted)
  Bottom 0.305: 6C4.2 6C3.+ 224.16,88.27 | 6R3.2 227.65,93.03 6VD1.C
N$21
  Top 0.305: 6VT3.C 6R14.2 213.36,106.05 6R15.1
N$22
  Bottom 0.305: 6C2.1 217.17,105.09 | 217.17,105.09 217.49,105.09 | DA7.3 217.49,102.23 217.17,105.09
N$23
  Bottom 0.305: 6R4.2 6R3.1
N$24  (1 unrouted)
N$52
  Bottom 0.305: 6R2.2 DA7.8
N$55
  Bottom 0.813: 5MA.3 6R8.2
N$59
  Bottom 0.813: 6R6.2 5MA.1
N$60  (2 unrouted)
N$61  (1 unrouted)
N$62
  Bottom 0.305: 104.78,105.73 104.84,105.93 | 104.84,105.93 H2.14 | DD1.1 103.5,98.42 102.87,98.74 103.19,105.73 104.84,105.93
N$65
  Bottom 0.813: 6VD2.C 6VD3.A
N$66
  Bottom 0.813: 6VD3.C 6VD4.A
N$67
  Bottom 0.406: 6R9.2 VT6.B
  Bottom 0.813: 6VD4.C 220.78,58.62 VT6.B
N$68
  Bottom 0.305: DD1.7 106.68,89.53 106.8,89.28 | 106.8,89.28 1Z2.2 | 1C8.2 106.8,89.28
N$69
  Bottom 0.305: DD1.8 105.09,86.68 107,85.41 110.17,85.41 1Z2.1 1C9.2
N$71  (1 unrouted)
N$72  (1 unrouted)
N$75
  Bottom 0.406: VT2.8 VT2.1
N$76
  Bottom 0.305: VT2.5 134.3,91.12
  Bottom 0.61: DA2.3 122.56,86.87 122.56,90.49 123.19,91.12 134.3,91.12
N$77
  Bottom 0.406: DA2.1 120.65,75.88 136.84,77.47 VT2.4
N$78
  Bottom 0.406: R20.2 119.06,84.77 DA2.2
N$79
  Bottom 0.406: DA2.5 125.41,84.77 C11.2 R21.1
N$80
  Bottom 0.406: RED.C DA1.7
N$81
  Bottom 0.406: GREEN.C DA1.6
N$82
  Bottom 0.406: RED.A R22.1
N$83
  Bottom 0.406: GREEN.A R23.1
N$84  (via drill 1 pad 2.18)  (1 unrouted)
  Top 0.406: v127.64,94.3 v127.64,101.28
  Bottom 0.406: R22.2 R23.2 | v127.64,101.28 R19.2 | DA1.8 v127.64,94.3
  Bottom 0.61: R19.2 124.78,99.8 DA1.4 | DA1.8 137.79,95.89 138.96,97.05 R22.2
N$85
  Bottom 0.406: X1.P1 124.09,104.09 R19.1
N$86
  Bottom 0.406: DA1.2 R24.2
N$87
  Bottom 0.305: DD1.30 100.65,105.73 98.74,106.68 H2.11
N$88
  Bottom 0.305: DD1.31 101.6,106.05 101.28,106.68 H2.12
N$89
  Bottom 0.305: DD1.32 102.55,106.36 H2.13
N$90
  Bottom 0.305: Q2.E Q1.E R14.1
N$91  (2 unrouted)
  Bottom 0.305: Q1.B 56.83,90.81 R9.1 D12.A C14.1 53.97,84.14
N$93  (1 unrouted)
  Bottom 0.305: R27.1 Q2.B 60.33,90.81 R26.2 C9.1 | 65.72,93.03 R17.1
N$95
  Top 0.305: 6VT3.B 6R13.2
N$96  (via drill 0.8 pad 2.3)
  Top 0.305: v216.22,108.27 6R15.2
  Bottom 0.305: 6VT2.G v216.22,108.27
N$97  (1 unrouted)
  Bottom 0.305: JP2.1 R28.2 R17.2 R14.2 54.93,97.79 D12.C R9.2
N$100
  Top 0.305: D3.A D7.A
  Bottom 0.305: Q2.C R31.2 D7.A
N$101  (2 unrouted)
  Bottom 0.305: R33.1 52.02,81.28 | 52.07,84.14 C14.2 | C15.1 C16.-
N$102
  Top 0.305: T9.B 67.02,85.42 D7.C
  Bottom 0.305: R32.2 T9.B
N$103
  Top 0.305: C16.+ JP1.1
  Bottom 0.305: C15.2 C16.+
PB3
  Bottom 0.305: 1R19.1 104.86,83.73 101.6,84.77 DD1.12
PB4
  Bottom 0.305: 1R20.1 100.56,85.17 DD1.13
PB5
  Bottom 0.305: 1R21.1 100.08,84.52 DD1.14
PC3  (2 unrouted)
PD1  (2 unrouted)
PD4  (via drill 0.6)  (1 unrouted)
  Top 0.305: v105.09,98.74 v80.64,95.25 75.88,95.25 75.88,89.53 T9.C D3.C
  Bottom 0.305: v80.64,95.25 H2.4 | 67.62,93.03 R28.1 74.3,95.89 | R27.2 D3.C | J_PD4.2 v105.09,98.74
RESET  (via drill 0.6)
  Top 0.305: v107.63,83.19 99.69,96.84 v99.38,96.84
  Bottom 0.305: ISP.5 107.95,76.83 v107.63,83.19 1R9.1 | v99.38,96.84 DD1.29
SCK  (1 unrouted)
  Top 0.305: ISP.3 97.16,83.82 96.84,85.41
  Bottom 0.305: 1R24.1 96.04,84.92 DD1.17
T1  (via drill 0.6)  (3 unrouted)
  Top 0.305: v102.23,77.79 95.89,84.14 v93.03,91.44
  Bottom 0.305: 1R19.2 1R20.2 v102.23,77.79 TEST1.P$5 | v93.03,91.44 DD1.23
T2  (via drill 0.6)  (4 unrouted)
  Top 0.305: v98.74,78.42 91.76,89.22 v91.44,92.08
  Bottom 0.305: 1R21.2 1R22.2 v98.74,78.42 TEST1.P$3 | v91.44,92.08 DD1.24
T3  (via drill 0.6)  (2 unrouted)
  Top 0.305: v94.3,78.42 90.49,89.22 v90.81,93.34
  Bottom 0.305: 1R23.2 1R24.2 v94.3,78.42 TEST1.P$1 | v90.81,93.34 DD1.25
U_BAT  (2 unrouted)
UGND
  Bottom 0.305: 136.21,92.06 VT2.7 VT2.6
  Bottom 0.406: X1.P5 X1.S4 X1.S2 X1.S6 X1.S5 X1.S1 X1.S3 R24.1
  Bottom 0.61: DA1.. 127.64,98.42 DA1.3 123.83,98.42 123.19,99.06 122.24,99.06 | 122.24,95.25 123.19,95.25 123.83,95.89 DA1.1 124.89,93.56 126.05,92.39 134.62,92.39 | 122.24,95.25 121.28,95.25 120.33,96.2 120.33,98.11 121.28,99.06 122.24,99.06 | R24.1 122.24,99.06 | R20.1 122.24,95.25 | 134.62,92.39 136.52,92.39 C12.2 | 136.21,92.06 134.62,92.39
  Bottom 0.813: C13.2 129.54,104.46 128.59,104.46 127.9,105.14 X1.S4
V+  (4 unrouted)
  Top 0.406: DA3.6 247.97,17.14 2R6.1 247.97,11.75 256.86,12.06 C4.+ C6.1
  Bottom 0.305: DA7.6 222.88,101.92 222.25,98.74 220.98,98.11 6R1B.1 6R1C.1 6R1A.1 219.71,92.71 212.72,92.71 6C1.+
Z_BLUE
  Bottom 0.305: DA7.7 223.52,100.33 223.52,98.11 | 223.52,98.11 223.52,97.79 | 6R2.1 6R1C.2 | 6R1C.2 6R1A.2 222.88,90.49 3L2B.1 | 6R1C.2 6R1B.2 223.52,98.11
Z_GREEN
  Bottom 0.305: 3L2G.1 DA7.1
Z_YELLOW
  Bottom 0.305: 6VD1.A 3L2Y.1
ZENER_A  (via drill 0.6)  (4 unrouted)
  Top 0.406: v151.13,73.03 119.38,82.87
(copper drawn outside any net)
  shapes: Top area x2, Top circle x6